# Altium project MotorBoard.PrjPcb
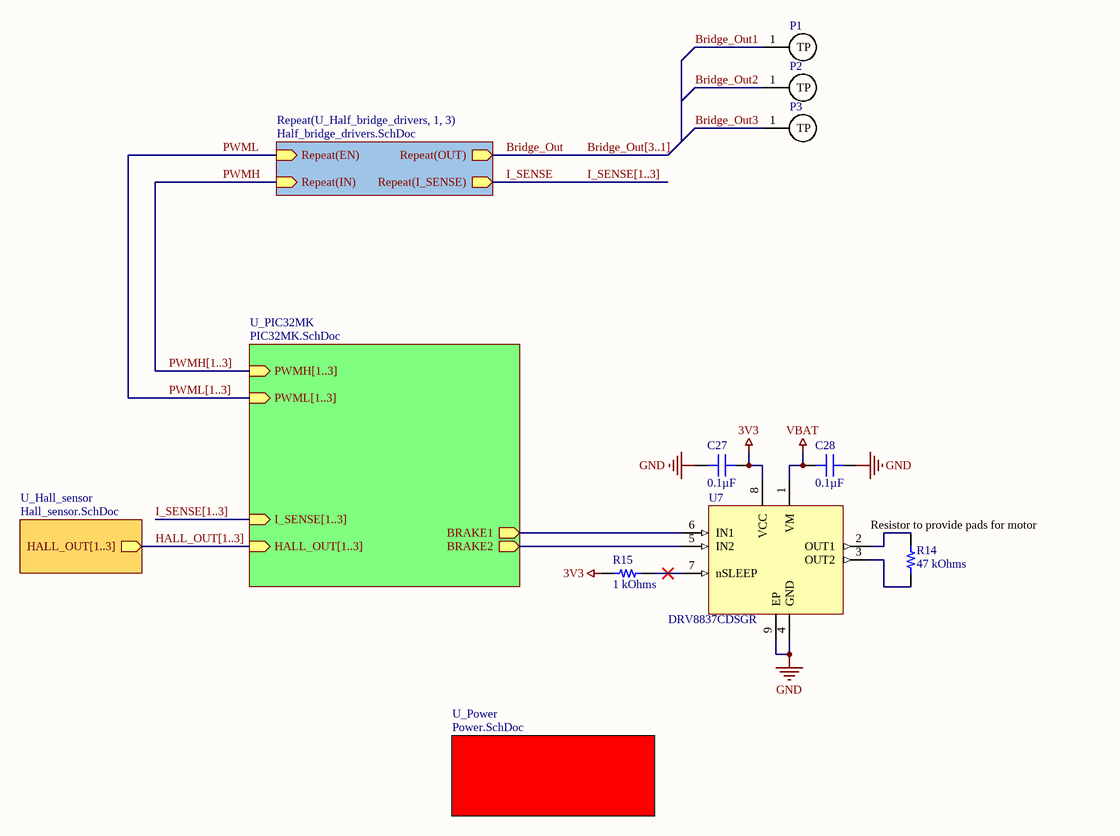
[diagram p0: Top.SchDoc]
7 sheets, 92 parts. Net scope: hierarchical (ports join the sheet entries above them; power ports are global).
Board file: MotorBoard.PcbDoc
Sheets:
  Top.SchDoc
    U_Half_bridge_drivers1 = Half_bridge_drivers.SchDoc
    U_Half_bridge_drivers2 = Half_bridge_drivers.SchDoc
    U_Half_bridge_drivers3 = Half_bridge_drivers.SchDoc
    U_Hall_sensor = Hall_sensor.SchDoc
    U_PIC32MK = PIC32MK.SchDoc
    U_Power = Power.SchDoc
      U_3V3_buck = 3V3_buck.SchDoc
      U_1V65_LDO = 1V65_LDO.SchDoc

## Sheet Top.SchDoc
size B; DocumentNumber: 7; Revision: 1.0; SheetNumber: 1; SheetTotal: 7

### Parts
C27  0.1µF  [CAP 0603_1608]
C28  0.1µF  [CAP 0603_1608]
P1  TP  [2mmHole]  (value not drawn)
P2  TP  [2mmHole]  (value not drawn)
P3  TP  [2mmHole]  (value not drawn)
R14  47 kOhms  [RES 2512_6432]
R15  1 kOhms  [RES 0603_1608]
U7  DRV8837CDSGR  [SON50P200X200X80-9N]

### Sub-sheets
Repeat(U_Half_bridge_drivers, 1, 3) = Half_bridge_drivers.SchDoc: Repeat(EN) (in), Repeat(IN) (in), Repeat(OUT) (out), Repeat(I_SENSE) (out)
U_Hall_sensor = Hall_sensor.SchDoc: HALL_OUT[1..3] (out)
U_PIC32MK = PIC32MK.SchDoc: I_SENSE[1..3] (in), HALL_OUT[1..3] (in), PWMH[1..3] (in), PWML[1..3] (in), BRAKE2 (out), BRAKE1 (out)
U_Power = Power.SchDoc: no entries

### Nets
3V3: C27.2 R15.2 U7.8(VCC)
GND: C27.1 C28.2 U7.4(GND) U7.9(EP)
VBAT: C28.1 U7.1(VM)
Bridge_Out: sheet Repeat(U_Half_bridge_drivers, 1, 3)/Repeat(OUT)
Bridge_Out1: P1.1(TP)
Bridge_Out2: P2.1(TP)
Bridge_Out3: P3.1(TP)
I_SENSE: sheet Repeat(U_Half_bridge_drivers, 1, 3)/Repeat(I_SENSE)
PWMH: sheet Repeat(U_Half_bridge_drivers, 1, 3)/Repeat(IN)
PWML: sheet Repeat(U_Half_bridge_drivers, 1, 3)/Repeat(EN)
NetR14_1: R14.1 U7.2(OUT1)
NetR14_2: R14.2 U7.3(OUT2)
NetR15_1: R15.1 U7.7(nSLEEP)
NetU6_53: U7.5(IN2) ; sheet U_PIC32MK/BRAKE2
NetU6_54: U7.6(IN1) ; sheet U_PIC32MK/BRAKE1

### Buses and harness runs
bus Bridge_Out[3..1]
bus HALL_OUT[1..3] = sheet U_Hall_sensor/HALL_OUT[1..3] = sheet U_PIC32MK/HALL_OUT[1..3]
bus I_SENSE[1..3]
bus I_SENSE[1..3] = sheet U_PIC32MK/I_SENSE[1..3]
bus PWMH[1..3] = sheet U_PIC32MK/PWMH[1..3]
bus PWML[1..3] = sheet U_PIC32MK/PWML[1..3]

### Notes on the sheet
- (near R14) Resistor to provide pads for motor

### Library data of the parts
C27 C28 = GCG188R92A104KA03D: CAP CER 0.1UF 100V 0603 EPOXY; Manufacturer: Murata Electronics; Temperature Coefficient: X8R; Tolerance: ±10%; Part Number: GCG188R92A104KA03D; Value: 0.1µF; Applications: Automotive; Capacitance: 0.1µF; ComponentLink1Description: Datasheet; ComponentLink1URL: https://search.murata.co.jp/Ceramy/image/img/A01X/G101/ENG/GCG188R92A104KA03-01.pdf; ComponentLink2Description: DigiKey Link; ComponentLink2URL: http://digikey.com/product-detail/en/murata-electronics/GCG188R92A104KA03D/490-18197-1-ND/9867926; Device Package: 0603 (1608 Metric); Features: Epoxy Mountable; LastUpdated: 21-Jan-20 12:01:59 AM; Lifecycle Status: Active; Minimum Order: 1; Mounting Type: Surface Mount, MLCC, Epoxy; Operating Temperature: -55°C ~ 150°C; Package / Case: 0603 (1608 Metric); Packaging: TapeAndReel; PartId: 9025; Part Status: Active; Price: 0.07; Ratings: AEC-Q200; Series: GCG; Size / Dimension: 0.063" L x 0.031" W (1.60mm x 0.80mm); Supplier 1: DigiKey; Supplier Part Number 1: 490-18197-1-ND; Thickness (Max): 0.035" (0.90mm); Voltage - Rated: 100V
R14 = RK73B3ATTE473J: RES 47K OHM 5% 1W 2512; Manufacturer: KOA Speer Electronics, Inc.; Temperature Coefficient: ±200ppm/°C; Part Number: RK73B3ATTE473J; ComponentLink1Description: Datasheet; ComponentLink1URL: http://www.koaspeer.com/catimages/Products/RK73B/RK73B.pdf; ComponentLink2Description: DigiKey Link; ComponentLink2URL: http://digikey.com/product-detail/en/koa-speer-electronics-inc/RK73B3ATTE473J/2019-RK73B3ATTE473JCT-ND/10425370; Composition: Thick Film; Device Package: 2512 (6432 Metric); Features: Automotive AEC-Q200, Moisture Resistant; Height - Seated (Max): 0.028" (0.70mm); LastUpdated: 21-Jan-20 4:26:21 AM; Lifecycle Status: Active; Minimum Order: 1; Number of Terminations: 2; Operating Temperature: -55°C ~ 155°C; Package / Case: 2512 (6432 Metric); Packaging: TapeAndReel; Part Status: Active; Power (Watts): 1W; Price: 0.04; Ratings: AEC-Q200; Resistance: 47 kOhms; Series: RK73B; Size / Dimension: 0.248" L x 0.122" W (6.30mm x 3.10mm); Supplier 1: DigiKey; Supplier Part Number 1: 2019-RK73B3ATTE473JCT-ND; Supplier Device Package: 2512; Tolerance: ±5%; Value: 47 kOhms
R15 = RT0603FRE071KL: RES SMD 1K OHM 1% 1/10W 0603; Manufacturer: Yageo; Power (Watts): 0.1W, 1/10W; Temperature Coefficient: ±50ppm/°C; Part Number: RT0603FRE071KL; Value: 1 kOhms; ComponentLink1Description: Datasheet; ComponentLink1URL: https://www.yageo.com/upload/media/product/productsearch/datasheet/rchip/PYu-RT_1-to-0.01_RoHS_L_11.pdf; ComponentLink2Description: DigiKey Link; ComponentLink2URL: http://digikey.com/product-detail/en/yageo/RT0603FRE071KL/YAG2323CT-ND/5252437; Composition: Thin Film; Device Package: 0603 (1608 Metric); Height - Seated (Max): 0.022" (0.55mm); LastUpdated: 21-Jan-20 12:24:38 AM; Lifecycle Status: Active; Minimum Order: 1; Number of Terminations: 2; Operating Temperature: -55°C ~ 155°C; Package / Case: 0603 (1608 Metric); Packaging: TapeAndReel; PartId: 5672; Part Status: Active; Price: 0.01; Resistance: 1 kOhms; Series: RT; Size / Dimension: 0.063" L x 0.031" W (1.60mm x 0.80mm); Supplier 1: DigiKey; Supplier Part Number 1: YAG2323CT-ND; Supplier Device Package: 0603; Tolerance: ±1%
U7 = DRV8837CDSGR: 11-V, 1-A H-bridge motor driver 8-WSON -40 to 85; MF: Texas Instruments; Mouser-Purchase-URL: https://snapeda.com/shop?store=Mouser&id=617854; Value: *; DigiKey-Purchase-URL: https://snapeda.com/shop?store=DigiKey&id=617854; Package: WSON-8 Texas Instruments; Texas_Instruments-Purchase-URL: https://snapeda.com/shop?store=Texas+Instruments&id=617854; Price: None; MP: DRV8837CDSGR; SnapEDA_Link: https://www.snapeda.com/parts/DRV8837CDSGR/Texas%20Instruments/view-part/617854/?ref=snap; Availability: Good

## Sheet Half_bridge_drivers.SchDoc
size B; DocumentNumber: 3; SheetNumber: 2; SheetTotal: 7
Used 3 times, as channels U_Half_bridge_drivers1, U_Half_bridge_drivers2, U_Half_bridge_drivers3. Parts and nets are listed once, with the designators drawn on the sheet.
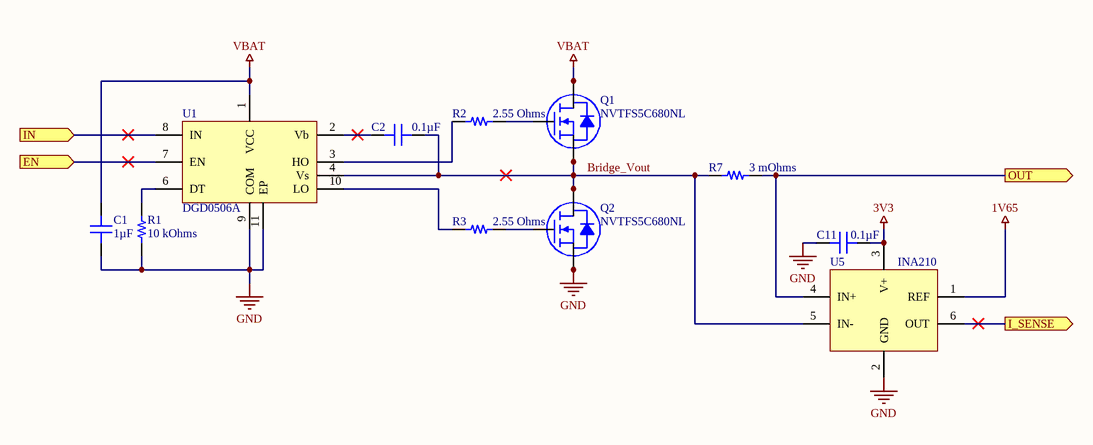
[diagram p1: Half_bridge_drivers.SchDoc]

### Parts
C1  1µF  [CAP 0603_1608]
C2  0.1µF  [CAP 0603_1608]
C11  0.1µF  [CAP 0603_1608]
Q1  NVTFS5C680NL  [NVTFS015N04CTAG]
Q2  NVTFS5C680NL  [NVTFS015N04CTAG]
R1  10 kOhms  [RES 0603_1608]
R2  2.55 Ohms  [RES 0603_1608]
R3  2.55 Ohms  [RES 0603_1608]
R7  3 mOhms  [STACKPOLE CSR0603]
U1  DGD0506A  [10-WDFN3030]
U5  INA210  [TI SC70-6 DCK]

### Ports
EN (in), I_SENSE (out), IN (in), OUT (out)

### Nets
1V65: U5.1(REF)
3V3: C11.2 U5.3(V+)
GND: C1.1 C11.1 Q2.1(S) Q2.2(S) Q2.3(S) R1.2 U1.9(COM) U1.11(EP) U5.2(GND)
VBAT: C1.2 Q1.5(D) Q1.6(D) Q1.7(D) Q1.8(D) U1.1(VCC)
Bridge_Vout: C2.1 Q1.1(S) Q1.2(S) Q1.3(S) Q2.5(D) Q2.6(D) Q2.7(D) Q2.8(D) R7.1 U1.4(Vs) U5.5(IN-)
EN: U1.7(EN) ; port EN
I_SENSE: U5.6(OUT) ; port I_SENSE
IN: U1.8(IN) ; port IN
OUT: R7.2 U5.4(IN+) ; port OUT
NetC2_2: C2.2 U1.2(Vb)
NetQ1_4: Q1.4(G) R2.2
NetQ2_4: Q2.4(G) R3.2
NetR1_1: R1.1 U1.6(DT)
NetR2_1: R2.1 U1.3(HO)
NetR3_1: R3.1 U1.10(LO)

### Channels
U_Half_bridge_drivers1: designators end in _1; ports EN=PWML1 I_SENSE=I_SENSE1 IN=PWMH1 OUT=Bridge_Out1
U_Half_bridge_drivers2: designators end in _2; ports EN=PWML2 I_SENSE=I_SENSE2 IN=PWMH2 OUT=Bridge_Out2
U_Half_bridge_drivers3: designators end in _3; ports EN=PWML3 I_SENSE=I_SENSE3 IN=PWMH3 OUT=Bridge_Out3

### Library data of the parts
C1 = GCJ188R71E105KA01D: CAP CER 1UF 25V X7R 0603; Manufacturer: Murata Electronics; Tolerance: ±10%; Part Number: GCJ188R71E105KA01D; Value: 1µF; Applications: Automotive, Boardflex Sensitive; Capacitance: 1µF; ComponentLink1Description: Datasheet; ComponentLink1URL: https://search.murata.co.jp/Ceramy/image/img/A01X/G101/ENG/GCJ188R71E105KA01-01.pdf; ComponentLink2Description: DigiKey Link; ComponentLink2URL: http://digikey.com/product-detail/en/murata-electronics/GCJ188R71E105KA01D/490-14409-1-ND/6606870; Device Package: 0603 (1608 Metric); Features: Soft Termination; LastUpdated: 21-Jan-20 12:01:58 AM; Lifecycle Status: Active; Minimum Order: 1; Mounting Type: Surface Mount, MLCC; Operating Temperature: -55°C ~ 125°C; Package / Case: 0603 (1608 Metric); Packaging: TapeAndReel; PartId: 9566; Part Status: Active; Price: 0.05; Ratings: AEC-Q200; Series: GCJ; Size / Dimension: 0.063" L x 0.031" W (1.60mm x 0.80mm); Supplier 1: DigiKey; Supplier Part Number 1: 490-14409-1-ND; Temperature Coefficient: X7R; Thickness (Max): 0.035" (0.90mm); Voltage - Rated: 25V
C2 C11 = GCG188R92A104KA03D: as C27 on sheet Top; Part Number: GCG188R92A104KA03D; Value: 0.1µF; Applications: Automotive; Capacitance: 0.1µF; ComponentLink1Description: Datasheet; ComponentLink1URL: https://search.murata.co.jp/Ceramy/image/img/A01X/G101/ENG/GCG188R92A104KA03-01.pdf; ComponentLink2Description: DigiKey Link; ComponentLink2URL: http://digikey.com/product-detail/en/murata-electronics/GCG188R92A104KA03D/490-18197-1-ND/9867926; Device Package: 0603 (1608 Metric); Features: Epoxy Mountable; LastUpdated: 21-Jan-20 12:01:59 AM; Lifecycle Status: Active; Minimum Order: 1; Mounting Type: Surface Mount, MLCC, Epoxy; Operating Temperature: -55°C ~ 150°C; Package / Case: 0603 (1608 Metric); Packaging: TapeAndReel; PartId: 9025; Part Status: Active; Price: 0.07; Ratings: AEC-Q200; Series: GCG; Size / Dimension: 0.063" L x 0.031" W (1.60mm x 0.80mm); Supplier 1: DigiKey; Supplier Part Number 1: 490-18197-1-ND; Thickness (Max): 0.035" (0.90mm); Voltage - Rated: 100V
R1 = RNCS0603BKE10K0: RES 10K OHM 0.1% 1/16W 0603; Manufacturer: Stackpole Electronics Inc; Power (Watts): 0.063W, 1/16W; Temperature Coefficient: ±25ppm/°C; Part Number: RNCS0603BKE10K0; Value: 10 kOhms; ComponentLink1Description: Datasheet; ComponentLink1URL: https://www.seielect.com/catalog/sei-rncs_rnch.pdf; ComponentLink2Description: DigiKey Link; ComponentLink2URL: http://digikey.com/product-detail/en/stackpole-electronics-inc/RNCS0603BKE10K0/RNCS0603BKE10K0CT-ND/1800113; Composition: Thin Film; Device Package: 0603 (1608 Metric); Features: Anti-Corrosive, Automotive AEC-Q200, Moisture Resistant; Height - Seated (Max): 0.022" (0.55mm); LastUpdated: 21-Jan-20 12:25:01 AM; Lifecycle Status: Active; Minimum Order: 1; Number of Terminations: 2; Operating Temperature: -55°C ~ 155°C; Package / Case: 0603 (1608 Metric); Packaging: TapeAndReel; PartId: 4838; Part Status: Active; Price: 0.08; Ratings: AEC-Q200; Resistance: 10 kOhms; Series: RNCS; Size / Dimension: 0.061" L x 0.031" W (1.55mm x 0.80mm); Supplier 1: DigiKey; Supplier Part Number 1: RNCS0603BKE10K0CT-ND; Supplier Device Package: 0603; Tolerance: ±0.1%
R2 R3 = CRCW06032R55FKEA: RES SMD 2.55 OHM 1% 1/10W 0603; Manufacturer: Vishay Dale; Power (Watts): 0.1W, 1/10W; Temperature Coefficient: ±100ppm/°C; Part Number: CRCW06032R55FKEA; Value: 2.55 Ohms; ComponentLink1Description: Datasheet; ComponentLink1URL: http://www.vishay.com/docs/20035/dcrcwe3.pdf; ComponentLink2Description: DigiKey Link; ComponentLink2URL: http://digikey.com/product-detail/en/vishay-dale/CRCW06032R55FKEA/541-2.55HHCT-ND/1962041; Composition: Thick Film; Device Package: 0603 (1608 Metric); Features: Automotive AEC-Q200; Height - Seated (Max): 0.020" (0.50mm); LastUpdated: 21-Jan-20 12:16:55 AM; Lifecycle Status: Active; Minimum Order: 1; Number of Terminations: 2; Operating Temperature: -55°C ~ 155°C; Package / Case: 0603 (1608 Metric); Packaging: CutTape; PartId: 23466; Part Status: Active; Price: 0.10; Ratings: AEC-Q200; Resistance: 2.55 Ohms; Series: CRCW; Size / Dimension: 0.061" L x 0.033" W (1.55mm x 0.85mm); Supplier 1: DigiKey; Supplier Part Number 1: 541-2.55HHCT-ND; Supplier Device Package: 0603; Tolerance: ±1%
R7 = CSS0603FT3L00: RES SHUNT, 0603, 0.003 OHM, 1%,; Manufacturer: Stackpole Electronics Inc; Power (Watts): 0.333W, 1/3W; Temperature Coefficient: ±100ppm/°C; Part Number: CSS0603FT3L00; ComponentLink2Description: DigiKey Link; ComponentLink2URL: http://digikey.com/product-detail/en/stackpole-electronics-inc/CSS0603FT3L00/738-CSS0603FT3L00CT-ND/10719388; Composition: Metal Element; Device Package: 0603 (1608 Metric); Features: Automotive AEC-Q200, Current Sense; Height - Seated (Max): 0.026" (0.65mm); LastUpdated: 19-Jul-20 11:45:32 PM; Lifecycle Status: Active; Minimum Order: 1; Number of Terminations: 2; Operating Temperature: -55°C ~ 155°C; Packaging: TapeAndReel; PartId: 1932; Part Status: Active; Price: 0.10; Ratings: AEC-Q200; Resistance: 3 mOhms; Series: CSS; Size / Dimension: 0.063" L x 0.031" W (1.60mm x 0.80mm); Supplier 1: DigiKey; Supplier Part Number 1: 738-CSS0603FT3L00CT-ND; Supplier Device Package: 0603; Tolerance: ±1%; Value: 3 mOhms
U1 = DGD0506A: Half Bridge driver - N FET
U5 = INA210: Current sense amplifier

## Sheet Hall_sensor.SchDoc
size B; DocumentNumber: 4; SheetNumber: 3; SheetTotal: 7
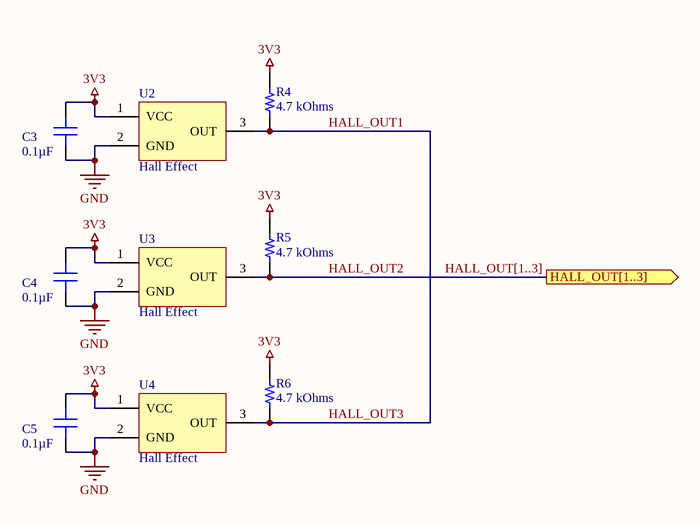
[diagram p2: Hall_sensor.SchDoc]

### Parts
C3  0.1µF  [CAP 0603_1608]
C4  0.1µF  [CAP 0603_1608]
C5  0.1µF  [CAP 0603_1608]
R4  4.7 kOhms  [RES 0603_1608]
R5  4.7 kOhms  [RES 0603_1608]
R6  4.7 kOhms  [RES 0603_1608]
U2  Hall Effect  [DRV5011ADLPG]
U3  Hall Effect  [DRV5011ADLPG]
U4  Hall Effect  [DRV5011ADLPG]

### Ports
HALL_OUT[1..3] (out)

### Nets
3V3: C3.1 C4.1 C5.1 R4.2 R5.1 R6.1 U2.1(VCC) U3.1(VCC) U4.1(VCC)
GND: C3.2 C4.2 C5.2 U2.2(GND) U3.2(GND) U4.2(GND)
HALL_OUT1: R4.1 U2.3(OUT)
HALL_OUT2: R5.2 U3.3(OUT)
HALL_OUT3: R6.2 U4.3(OUT)

### Buses and harness runs
bus HALL_OUT[1..3] = port HALL_OUT[1..3]

### Library data of the parts
C3-C5 = GCG188R92A104KA03D: as C27 on sheet Top; Part Number: GCG188R92A104KA03D; Value: 0.1µF; Applications: Automotive; Capacitance: 0.1µF; ComponentLink1Description: Datasheet; ComponentLink1URL: https://search.murata.co.jp/Ceramy/image/img/A01X/G101/ENG/GCG188R92A104KA03-01.pdf; ComponentLink2Description: DigiKey Link; ComponentLink2URL: http://digikey.com/product-detail/en/murata-electronics/GCG188R92A104KA03D/490-18197-1-ND/9867926; Device Package: 0603 (1608 Metric); Features: Epoxy Mountable; LastUpdated: 21-Jan-20 12:01:59 AM; Lifecycle Status: Active; Minimum Order: 1; Mounting Type: Surface Mount, MLCC, Epoxy; Operating Temperature: -55°C ~ 150°C; Package / Case: 0603 (1608 Metric); Packaging: TapeAndReel; PartId: 9025; Part Status: Active; Price: 0.07; Ratings: AEC-Q200; Series: GCG; Size / Dimension: 0.063" L x 0.031" W (1.60mm x 0.80mm); Supplier 1: DigiKey; Supplier Part Number 1: 490-18197-1-ND; Thickness (Max): 0.035" (0.90mm); Voltage - Rated: 100V
R4-R6 = CRCW06034K70FKTA: RES SMD 4.7K OHM 1% 1/10W 0603; Manufacturer: Vishay Dale; Power (Watts): 0.1W, 1/10W; Temperature Coefficient: ±100ppm/°C; Part Number: CRCW06034K70FKTA; Value: 4.7 kOhms; ComponentLink1Description: Datasheet; ComponentLink1URL: http://www.vishay.com/docs/20008/dcrcw.pdf; ComponentLink2Description: DigiKey Link; ComponentLink2URL: http://digikey.com/product-detail/en/vishay-dale/CRCW06034K70FKTA/541-3004-1-ND/6073647; Composition: Thick Film; Device Package: 0603 (1608 Metric); Features: Automotive AEC-Q200; Height - Seated (Max): 0.020" (0.50mm); LastUpdated: 21-Jan-20 12:16:37 AM; Lifecycle Status: Active; Minimum Order: 1; Number of Terminations: 2; Operating Temperature: -55°C ~ 155°C; Package / Case: 0603 (1608 Metric); Packaging: TapeAndReel; PartId: 23863; Part Status: Active; Price: 0.01; Ratings: AEC-Q200; Resistance: 4.7 kOhms; Series: CRCW; Size / Dimension: 0.063" L x 0.033" W (1.60mm x 0.85mm); Supplier 1: DigiKey; Supplier Part Number 1: 541-3004-1-ND; Supplier Device Package: 0603; Tolerance: ±1%
U2-U4 = DRV5011

## Sheet PIC32MK.SchDoc
size B; DocumentNumber: 5; SheetNumber: 4; SheetTotal: 7
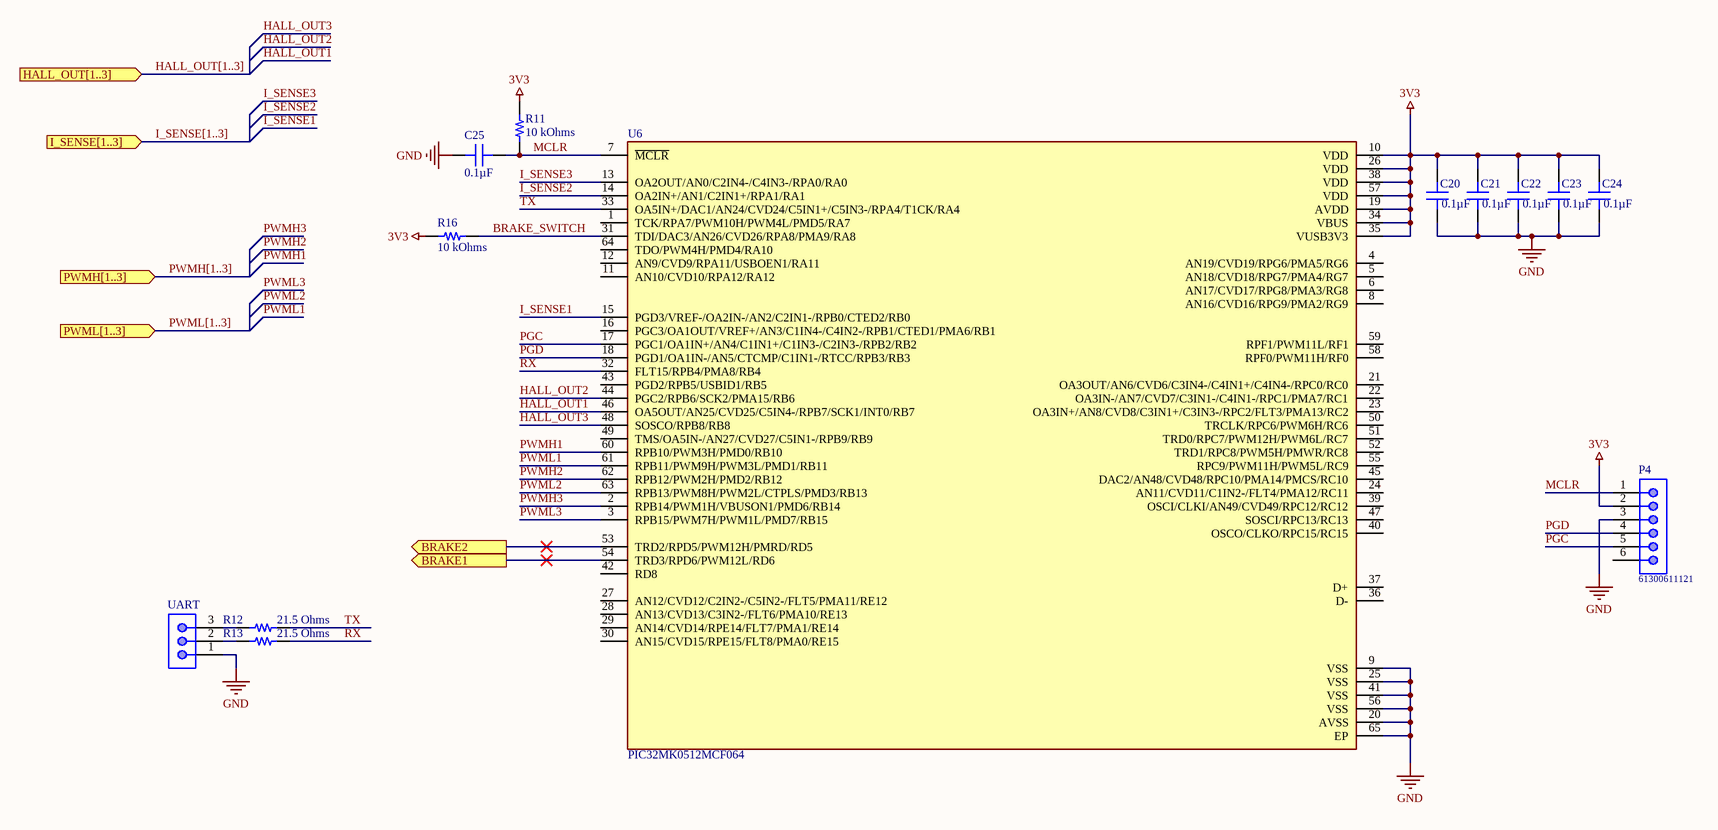
[diagram p3: PIC32MK.SchDoc]

### Parts
C20  0.1µF  [CAP 0603_1608]
C21  0.1µF  [CAP 0603_1608]
C22  0.1µF  [CAP 0603_1608]
C23  0.1µF  [CAP 0603_1608]
C24  0.1µF  [CAP 0603_1608]
C25  0.1µF  [CAP 0603_1608]
P4  61300611121  [61300611121]
R11  10 kOhms  [RES 0603_1608]
R12  21.5 Ohms  [RES 0603_1608]
R13  21.5 Ohms  [RES 0603_1608]
R16  10 kOhms  [RES 0603_1608]
U6  PIC32MK0512MCF064  [QFN50P900X900X100-65N]
UART  3 pin 2mm JST Male  [3pin - 2mm header]  (value not drawn)

### Ports
BRAKE1 (out), BRAKE2 (out), HALL_OUT[1..3] (in), I_SENSE[1..3] (in), PWMH[1..3] (in), PWML[1..3] (in)

### Nets
3V3: C20.1 C21.1 C22.1 C23.1 C24.1 P4.2 R11.2 R16.2 U6.10(VDD) U6.19(AVDD) U6.26(VDD) U6.34(VBUS) U6.35(VUSB3V3) U6.38(VDD) U6.57(VDD)
GND: C20.2 C21.2 C22.2 C23.2 C24.2 C25.2 P4.3 U6.9(VSS) U6.20(AVSS) U6.25(VSS) U6.41(VSS) U6.56(VSS) U6.65(EP) UART.1
BRAKE_SWITCH: R16.1 U6.31(TDI/DAC3/AN26/CVD26/RPA8/PMA9/RA8)
HALL_OUT1: U6.46(OA5OUT/AN25/CVD25/C5IN4-/RPB7/SCK1/INT0/RB7)
HALL_OUT2: U6.44(PGC2/RPB6/SCK2/PMA15/RB6)
HALL_OUT3: U6.48(SOSCO/RPB8/RB8)
I_SENSE1: U6.15(PGD3/VREF-/OA2IN-/AN2/C2IN1-/RPB0/CTED2/RB0)
I_SENSE2: U6.14(OA2IN+/AN1/C2IN1+/RPA1/RA1)
I_SENSE3: U6.13(OA2OUT/AN0/C2IN4-/C4IN3-/RPA0/RA0)
MCLR: C25.1 P4.1 R11.1 U6.7(~{MCLR})
PGC: P4.5 U6.17(PGC1/OA1IN+/AN4/C1IN1+/C1IN3-/C2IN3-/RPB2/RB2)
PGD: P4.4 U6.18(PGD1/OA1IN-/AN5/CTCMP/C1IN1-/RTCC/RPB3/RB3)
PWMH1: U6.60(RPB10/PWM3H/PMD0/RB10)
PWMH2: U6.62(RPB12/PWM2H/PMD2/RB12)
PWMH3: U6.2(RPB14/PWM1H/VBUSON1/PMD6/RB14)
PWML1: U6.61(RPB11/PWM9H/PWM3L/PMD1/RB11)
PWML2: U6.63(RPB13/PWM8H/PWM2L/CTPLS/PMD3/RB13)
PWML3: U6.3(RPB15/PWM7H/PWM1L/PMD7/RB15)
RX: R13.2 U6.32(FLT15/RPB4/PMA8/RB4)
TX: R12.2 U6.33(OA5IN+/DAC1/AN24/CVD24/C5IN1+/C5IN3-/RPA4/T1CK/RA4)
NetR12_1: R12.1 UART.3
NetR13_1: R13.1 UART.2
NetU6_53: U6.53(TRD2/RPD5/PWM12H/PMRD/RD5) ; port BRAKE2
NetU6_54: U6.54(TRD3/RPD6/PWM12L/RD6) ; port BRAKE1

Not connected (* = marked no-connect by the designer): P4 6; U6 1(TCK/RPA7/PWM10H/PWM4L/PMD5/RA7) 4(AN19/CVD19/RPG6/PMA5/RG6) 5(AN18/CVD18/RPG7/PMA4/RG7) 6(AN17/CVD17/RPG8/PMA3/RG8) 8(AN16/CVD16/RPG9/PMA2/RG9) 11(AN10/CVD10/RPA12/RA12) 12(AN9/CVD9/RPA11/USBOEN1/RA11) 16(PGC3/OA1OUT/VREF+/AN3/C1IN4-/C4IN2-/RPB1/CTED1/PMA6/RB1) 21(OA3OUT/AN6/CVD6/C3IN4-/C4IN1+/C4IN4-/RPC0/RC0) 22(OA3IN-/AN7/CVD7/C3IN1-/C4IN1-/RPC1/PMA7/RC1) 23(OA3IN+/AN8/CVD8/C3IN1+/C3IN3-/RPC2/FLT3/PMA13/RC2) 24(AN11/CVD11/C1IN2-/FLT4/PMA12/RC11) 27(AN12/CVD12/C2IN2-/C5IN2-/FLT5/PMA11/RE12) 28(AN13/CVD13/C3IN2-/FLT6/PMA10/RE13) 29(AN14/CVD14/RPE14/FLT7/PMA1/RE14) 30(AN15/CVD15/RPE15/FLT8/PMA0/RE15) 36(D-) 37(D+) 39(OSCI/CLKI/AN49/CVD49/RPC12/RC12) 40(OSCO/CLKO/RPC15/RC15) 42(RD8) 43(PGD2/RPB5/USBID1/RB5) 45(DAC2/AN48/CVD48/RPC10/PMA14/PMCS/RC10) 47(SOSCI/RPC13/RC13) 49(TMS/OA5IN-/AN27/CVD27/C5IN1-/RPB9/RB9) 50(TRCLK/RPC6/PWM6H/RC6) 51(TRD0/RPC7/PWM12H/PWM6L/RC7) 52(TRD1/RPC8/PWM5H/PMWR/RC8) 55(RPC9/PWM11H/PWM5L/RC9) 58(RPF0/PWM11H/RF0) 59(RPF1/PWM11L/RF1) 64(TDO/PWM4H/PMD4/RA10)

### Buses and harness runs
bus HALL_OUT[1..3] = port HALL_OUT[1..3]
bus I_SENSE[1..3] = port I_SENSE[1..3]
bus PWMH[1..3] = port PWMH[1..3]
bus PWML[1..3] = port PWML[1..3]

### Library data of the parts
C20-C25 = GCG188R92A104KA03D: as C27 on sheet Top; Part Number: GCG188R92A104KA03D; Value: 0.1µF; Applications: Automotive; Capacitance: 0.1µF; ComponentLink1Description: Datasheet; ComponentLink1URL: https://search.murata.co.jp/Ceramy/image/img/A01X/G101/ENG/GCG188R92A104KA03-01.pdf; ComponentLink2Description: DigiKey Link; ComponentLink2URL: http://digikey.com/product-detail/en/murata-electronics/GCG188R92A104KA03D/490-18197-1-ND/9867926; Device Package: 0603 (1608 Metric); Features: Epoxy Mountable; LastUpdated: 21-Jan-20 12:01:59 AM; Lifecycle Status: Active; Minimum Order: 1; Mounting Type: Surface Mount, MLCC, Epoxy; Operating Temperature: -55°C ~ 150°C; Package / Case: 0603 (1608 Metric); Packaging: TapeAndReel; PartId: 9025; Part Status: Active; Price: 0.07; Ratings: AEC-Q200; Series: GCG; Size / Dimension: 0.063" L x 0.031" W (1.60mm x 0.80mm); Supplier 1: DigiKey; Supplier Part Number 1: 490-18197-1-ND; Thickness (Max): 0.035" (0.90mm); Voltage - Rated: 100V
P4 = 61300611121: WR-PHD Pin Header, THT, pitch 2.54mm, Single Row, Vertical, 6p; Manufacturer: Wurth Elektronik; Pin Number: 6; Rated Current: 3A; Working Voltage: 250VAC; Withstanding Voltage: 500VAC; Contact Resistance: 20mOhm; ComponentLink1Description: Manufacturer; ComponentLink1URL: http://www.we-online.de; ComponentLink2Description: Datasheet; ComponentLink2URL: https://www.we-online.com/catalog/datasheet/61300611121.pdf; Manufacturer Part Number: 61300611121; Published Date: May 2020; Pitch: 2.54mm; Operating Temperature: -40 to +105degC; Mounting Technology: THT; Packaging: Bag; Gender: Pin Header; Row Number: Single; Orientation: Vertical
R11 R16 = RNCS0603BKE10K0: as R1 on sheet Half_bridge_drivers; Part Number: RNCS0603BKE10K0; Value: 10 kOhms; ComponentLink1Description: Datasheet; ComponentLink1URL: https://www.seielect.com/catalog/sei-rncs_rnch.pdf; ComponentLink2Description: DigiKey Link; ComponentLink2URL: http://digikey.com/product-detail/en/stackpole-electronics-inc/RNCS0603BKE10K0/RNCS0603BKE10K0CT-ND/1800113; Composition: Thin Film; Device Package: 0603 (1608 Metric); Features: Anti-Corrosive, Automotive AEC-Q200, Moisture Resistant; Height - Seated (Max): 0.022" (0.55mm); LastUpdated: 21-Jan-20 12:25:01 AM; Lifecycle Status: Active; Minimum Order: 1; Number of Terminations: 2; Operating Temperature: -55°C ~ 155°C; Package / Case: 0603 (1608 Metric); Packaging: TapeAndReel; PartId: 4838; Part Status: Active; Price: 0.08; Ratings: AEC-Q200; Resistance: 10 kOhms; Series: RNCS; Size / Dimension: 0.061" L x 0.031" W (1.55mm x 0.80mm); Supplier 1: DigiKey; Supplier Part Number 1: RNCS0603BKE10K0CT-ND; Supplier Device Package: 0603; Tolerance: ±0.1%
R12 R13 = ERJ-3EKF21R5V: RES SMD 21.5 OHM 1% 1/10W 0603; Manufacturer: Panasonic Electronic Components; Power (Watts): 0.1W, 1/10W; Temperature Coefficient: ±100ppm/°C; Part Number: ERJ-3EKF21R5V; Value: 21.5 Ohms; ComponentLink1Description: Datasheet; ComponentLink1URL: https://industrial.panasonic.com/cdbs/www-data/pdf/RDA0000/AOA0000C304.pdf; ComponentLink2Description: DigiKey Link; ComponentLink2URL: http://digikey.com/product-detail/en/panasonic-electronic-components/ERJ-3EKF21R5V/P21.5HCT-ND/198246; Composition: Thick Film; Device Package: 0603 (1608 Metric); Features: Automotive AEC-Q200; Height - Seated (Max): 0.022" (0.55mm); LastUpdated: 21-Jan-20 12:16:19 AM; Lifecycle Status: Active; Minimum Order: 1; Number of Terminations: 2; Operating Temperature: -55°C ~ 155°C; Package / Case: 0603 (1608 Metric); Packaging: TapeAndReel; PartId: 24202; Part Status: Active; Price: 0.01; Ratings: AEC-Q200; Resistance: 21.5 Ohms; Series: ERJ; Size / Dimension: 0.063" L x 0.031" W (1.60mm x 0.80mm); Supplier 1: DigiKey; Supplier Part Number 1: P21.5HCT-ND; Supplier Device Package: 0603; Tolerance: ±1%
U6 = PIC32MK0512MCF064: PIC32MK Microcontroller IC 32-Bit 120MHz 1MB _1M x 8_ FLASH 64-TQFP _10x10_; MP: PIC32MK1024MCF064-I/PT; MF: Microchip; Digi-Key_Purchase_URL: https://www.digikey.kr/product-detail/en/microchip-technology/PIC32MK1024MCF064-I-PT/PIC32MK1024MCF064-I-PT-ND/7164902?utm_source=snapeda&utm_medium=aggregator&utm_campaign=symbol; Package: TQFP-64 Microchip; Digi-Key_Part_Number: PIC32MK1024MCF064-I/PT-ND; Value: *; SnapEDA_Link: https://www.snapeda.com/parts/PIC32MK1024MCF064-I/PT/Microchip/view-part/876704/?ref=snap

## Sheet Power.SchDoc
size B; DocumentNumber: 6; SheetNumber: 5; SheetTotal: 7
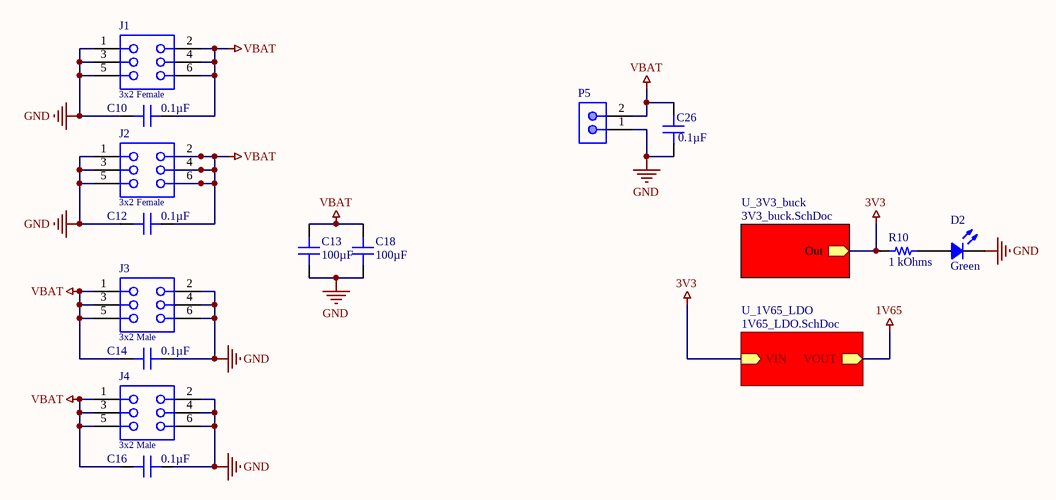
[diagram p4: Power.SchDoc]

### Parts
C10  0.1µF  [CAP 0603_1608]
C12  0.1µF  [CAP 0603_1608]
C13  100µF  [CAP 1210_3225 - 2.8MM]
C14  0.1µF  [CAP 0603_1608]
C16  0.1µF  [CAP 0603_1608]
C18  100µF  [CAP 1210_3225 - 2.8MM]
C26  0.1µF  [CAP 0603_1608]
D2  Green  [LED 0603_1608 GREEN]
J1  3x2 Female  [62000621821]
J2  3x2 Female  [62000621821]
J3  3x2 Male  [2mm 3x2 Male Right - duplicate]
J4  3x2 Male  [2mm 3x2 Male Right - duplicate]
P5  2 pin 2mm JST Male  [2pin - 2mm JST male]  (value not drawn)
R10  1 kOhms  [RES 0603_1608]

### Sub-sheets
U_1V65_LDO = 1V65_LDO.SchDoc: VOUT (out), VIN (in)
U_3V3_buck = 3V3_buck.SchDoc: Out (out)

### Nets
3V3: R10.1 ; sheet U_3V3_buck/Out, sheet U_1V65_LDO/VIN
GND: C10.1 C12.1 C13.1 C14.2 C16.2 C18.1 C26.2 D2.2 J1.1 J1.3 J1.5 J2.1 J2.3 J2.5 J3.2 J3.4 J3.6 J4.2 J4.4 J4.6 P5.1
VBAT: C10.2 C12.2 C13.2 C14.1 C16.1 C18.2 C26.1 J1.2 J1.4 J1.6 J2.2 J2.4 J2.6 J3.1 J3.3 J3.5 J4.1 J4.3 J4.5 P5.2
NetD2_1: D2.1 R10.2

### Library data of the parts
C10 C12 C14 C16 C26 = GCG188R92A104KA03D: as C27 on sheet Top; Part Number: GCG188R92A104KA03D; Value: 0.1µF; Applications: Automotive; Capacitance: 0.1µF; ComponentLink1Description: Datasheet; ComponentLink1URL: https://search.murata.co.jp/Ceramy/image/img/A01X/G101/ENG/GCG188R92A104KA03-01.pdf; ComponentLink2Description: DigiKey Link; ComponentLink2URL: http://digikey.com/product-detail/en/murata-electronics/GCG188R92A104KA03D/490-18197-1-ND/9867926; Device Package: 0603 (1608 Metric); Features: Epoxy Mountable; LastUpdated: 21-Jan-20 12:01:59 AM; Lifecycle Status: Active; Minimum Order: 1; Mounting Type: Surface Mount, MLCC, Epoxy; Operating Temperature: -55°C ~ 150°C; Package / Case: 0603 (1608 Metric); Packaging: TapeAndReel; PartId: 9025; Part Status: Active; Price: 0.07; Ratings: AEC-Q200; Series: GCG; Size / Dimension: 0.063" L x 0.031" W (1.60mm x 0.80mm); Supplier 1: DigiKey; Supplier Part Number 1: 490-18197-1-ND; Thickness (Max): 0.035" (0.90mm); Voltage - Rated: 100V
C13 C18 = EMK325ABJ107MM-P: CAP CER 100UF 16V X5R 1210; Manufacturer: Taiyo Yuden; Tolerance: ±20%; Part Number: EMK325ABJ107MM-P; Value: 100µF; Applications: General Purpose; Capacitance: 100µF; ComponentLink1Description: Datasheet; ComponentLink1URL: https://ds.yuden.co.jp/TYCOMPAS/ut/detail?pn=EMK325ABJ107MM-P &u=M; ComponentLink2Description: DigiKey Link; ComponentLink2URL: http://digikey.com/product-detail/en/taiyo-yuden/EMK325ABJ107MM-P/587-5426-1-ND/7067102; Device Package: 1210 (3225 Metric); LastUpdated: 21-Jan-20 12:30:21 AM; Lifecycle Status: Active; Minimum Order: 1; Mounting Type: Surface Mount, MLCC; Operating Temperature: -55°C ~ 85°C; Package / Case: 1210 (3225 Metric); Packaging: TapeAndReel; PartId: 24141; Part Status: Active; Price: 0.71; Series: M; Size / Dimension: 0.126" L x 0.098" W (3.20mm x 2.50mm); Supplier 1: DigiKey; Supplier Part Number 1: 587-5426-1-ND; Temperature Coefficient: X5R; Thickness (Max): 0.110" (2.80mm); Voltage - Rated: 16V
D2 = XZCDGK53W-8VF: 1.6X0.8MM LC GREEN PIXSOLED DOME; Manufacturer: SunLED; Configuration: Independent; Current - Test: 2mA; Lens Color: Colorless; Lens Size: 0.35mm Dia; Lens Style: Round with Domed Top; Lens Transparency: Clear; Millicandela Rating: 417mcd; Viewing Angle: 60°; Voltage - Forward (Vf) (Typ): 2.65V; Wavelength - Dominant: 525nm; Wavelength - Peak: 515nm; Part Number: XZCDGK53W-8VF; Color: Green; ComponentLink1Description: Datasheet; ComponentLink1URL: https://www.sunledusa.com/products/spec/XZCDGK53W-8VF.pdf; ComponentLink2Description: DigiKey Link; ComponentLink2URL: http://digikey.com/product-detail/en/sunled/XZCDGK53W-8VF/1497-XZCDGK53W-8VFCT-ND/10449792; Device Package: 0603 (1608 Metric); Height (Max): 1.10mm; LastUpdated: 21-Jan-20 3:12:09 AM; Lifecycle Status: Active; Minimum Order: 1; Mounting Type: Surface Mount; Package / Case: 0603 (1608 Metric); Packaging: Unknown; PartId: 938; Part Status: Active; Price: 0.18; Series: Ultra Low Current; Size / Dimension: 1.60mm L x 0.80mm W; Supplier 1: DigiKey; Supplier Part Number 1: 1497-XZCDGK53W-8VFCT-ND; Supplier Device Package: 2-SMD; Value: Green
J1 J2 = 62000621821: WR-PHD Socket Header, THT, pitch 2mm, Dual Row, Vertical, 6p; Manufacturer: Wurth Elektronik; Pin Number: 6; Rated Current: 2A; Working Voltage: 250VAC; Withstanding Voltage: 500VAC; Contact Resistance: 20mOhm; ComponentLink1Description: Manufacturer; ComponentLink1URL: http://www.we-online.de; ComponentLink2Description: Datasheet; ComponentLink2URL: https://www.we-online.com/catalog/datasheet/62000621821.pdf; Manufacturer Part Number: 62000621821; Published Date: May 2020; Pitch: 2mm; Operating Temperature: -40 to +105degC; Mounting Technology: THT; Packaging: Tube; Gender: Socket Header; Row Number: Dual; Orientation: Vertical
J3 J4 = 2mm Male 3x2 Right: Manufacturer Part Number: 62000621821; Manufacturer: Wurth Elektronik; Pin Number: 6; Gender: Socket Header; Rated Current: 2A; Working Voltage: 250VAC; Withstanding Voltage: 500VAC; Contact Resistance: 20mOhm; Row Number: Dual; ComponentLink1Description: Manufacturer; ComponentLink1URL: http://www.we-online.de; ComponentLink2Description: Datasheet; ComponentLink2URL: https://www.we-online.com/catalog/datasheet/62000621821.pdf; Published Date: May 2020; Pitch: 2mm; Operating Temperature: -40 to +105degC; Mounting Technology: THT; Packaging: Tube; Orientation: Vertical
R10 = RNCF0603DTE1K00: RES 1K OHM 0.5% 1/10W 0603; Manufacturer: Stackpole Electronics Inc; Power (Watts): 0.1W, 1/10W; Temperature Coefficient: ±25ppm/°C; Part Number: RNCF0603DTE1K00; Value: 1 kOhms; ComponentLink1Description: Datasheet; ComponentLink1URL: https://www.seielect.com/catalog/sei-rncf.pdf; ComponentLink2Description: DigiKey Link; ComponentLink2URL: http://digikey.com/product-detail/en/stackpole-electronics-inc/RNCF0603DTE1K00/RNCF0603DTE1K00CT-ND/9915086; Composition: Thin Film; Device Package: 0603 (1608 Metric); Features: Automotive AEC-Q200; Height - Seated (Max): 0.022" (0.55mm); LastUpdated: 21-Jan-20 12:14:28 AM; Lifecycle Status: Active; Minimum Order: 1; Number of Terminations: 2; Operating Temperature: -55°C ~ 155°C; Package / Case: 0603 (1608 Metric); Packaging: TapeAndReel; PartId: 26300; Part Status: Active; Price: 0.05; Ratings: AEC-Q200; Resistance: 1 kOhms; Series: RNCF; Size / Dimension: 0.061" L x 0.031" W (1.55mm x 0.80mm); Supplier 1: DigiKey; Supplier Part Number 1: RNCF0603DTE1K00CT-ND; Supplier Device Package: 0603; Tolerance: ±0.5%

## Sheet 3V3_buck.SchDoc
size B; DocumentNumber: 2; SheetNumber: 7; SheetTotal: 7
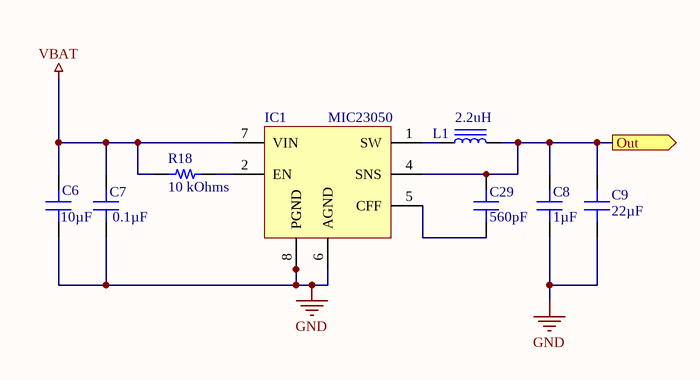
[diagram p5: 3V3_buck.SchDoc]

### Parts
C6  10µF  [CAP 0805_2012]
C7  0.1µF  [CAP 0603_1608]
C8  1µF  [CAP 0603_1608]
C9  22µF  [CAP 0805_2012]
C29  560pF  [CAP 0603_1608]
IC1  MIC23050  [MLF-8 2x2mm]
L1  2.2uH  [IND 0806_2016]
R18  10 kOhms  [RES 0603_1608]

### Ports
Out (out)

### Nets
3V3: C8.2 C9.2 C29.2 IC1.4(SNS) L1.2 ; port Out
GND: C6.1 C7.2 C8.1 C9.1 IC1.6(AGND) IC1.8(PGND) IC1.9(PGND)
VBAT: C6.2 C7.1 IC1.7(VIN) R18.2
NetC29_1: C29.1 IC1.5(CFF)
NetIC1_1: IC1.1(SW) L1.1
NetIC1_2: IC1.2(EN) R18.1

### Library data of the parts
C6 = C2012X7S1E106K125AC: CAP CER 10UF 25V X7S 0805; Manufacturer: TDK Corporation; Tolerance: ±10%; Part Number: C2012X7S1E106K125AC; Value: 10µF; Applications: General Purpose; Capacitance: 10µF; ComponentLink1Description: Datasheet; ComponentLink1URL: https://product.tdk.com/en/search/capacitor/ceramic/mlcc/info?part_no=C2012X7S1E106K125AC?ref_disty=digikey; ComponentLink2Description: DigiKey Link; ComponentLink2URL: http://digikey.com/product-detail/en/tdk-corporation/C2012X7S1E106K125AC/445-181600-1-ND/9991478; Device Package: 0805 (2012 Metric); Features: Low ESL; LastUpdated: 21-Jan-20 12:03:04 AM; Lifecycle Status: Active; Minimum Order: 1; Mounting Type: Surface Mount, MLCC; Operating Temperature: -55°C ~ 125°C; Package / Case: 0805 (2012 Metric); Packaging: TapeAndReel; PartId: 3339; Part Status: Active; Price: 0.15; Series: C; Size / Dimension: 0.079" L x 0.049" W (2.00mm x 1.25mm); Supplier 1: DigiKey; Supplier Part Number 1: 445-181600-1-ND; Temperature Coefficient: X7S; Thickness (Max): 0.057" (1.45mm); Voltage - Rated: 25V
C7 = GCG188R92A104KA03D: as C27 on sheet Top; Part Number: GCG188R92A104KA03D; Value: 0.1µF; Applications: Automotive; Capacitance: 0.1µF; ComponentLink1Description: Datasheet; ComponentLink1URL: https://search.murata.co.jp/Ceramy/image/img/A01X/G101/ENG/GCG188R92A104KA03-01.pdf; ComponentLink2Description: DigiKey Link; ComponentLink2URL: http://digikey.com/product-detail/en/murata-electronics/GCG188R92A104KA03D/490-18197-1-ND/9867926; Device Package: 0603 (1608 Metric); Features: Epoxy Mountable; LastUpdated: 21-Jan-20 12:01:59 AM; Lifecycle Status: Active; Minimum Order: 1; Mounting Type: Surface Mount, MLCC, Epoxy; Operating Temperature: -55°C ~ 150°C; Package / Case: 0603 (1608 Metric); Packaging: TapeAndReel; PartId: 9025; Part Status: Active; Price: 0.07; Ratings: AEC-Q200; Series: GCG; Size / Dimension: 0.063" L x 0.031" W (1.60mm x 0.80mm); Supplier 1: DigiKey; Supplier Part Number 1: 490-18197-1-ND; Thickness (Max): 0.035" (0.90mm); Voltage - Rated: 100V
C8 = GCJ188R71E105KA01D: as C1 on sheet Half_bridge_drivers; Part Number: GCJ188R71E105KA01D; Value: 1µF; Applications: Automotive, Boardflex Sensitive; Capacitance: 1µF; ComponentLink1Description: Datasheet; ComponentLink1URL: https://search.murata.co.jp/Ceramy/image/img/A01X/G101/ENG/GCJ188R71E105KA01-01.pdf; ComponentLink2Description: DigiKey Link; ComponentLink2URL: http://digikey.com/product-detail/en/murata-electronics/GCJ188R71E105KA01D/490-14409-1-ND/6606870; Device Package: 0603 (1608 Metric); Features: Soft Termination; LastUpdated: 21-Jan-20 12:01:58 AM; Lifecycle Status: Active; Minimum Order: 1; Mounting Type: Surface Mount, MLCC; Operating Temperature: -55°C ~ 125°C; Package / Case: 0603 (1608 Metric); Packaging: TapeAndReel; PartId: 9566; Part Status: Active; Price: 0.05; Ratings: AEC-Q200; Series: GCJ; Size / Dimension: 0.063" L x 0.031" W (1.60mm x 0.80mm); Supplier 1: DigiKey; Supplier Part Number 1: 490-14409-1-ND; Temperature Coefficient: X7R; Thickness (Max): 0.035" (0.90mm); Voltage - Rated: 25V
C9 = CL21A226MOQNNNE: CAP CER 22UF 16V X5R 0805; Manufacturer: Samsung Electro-Mechanics; Tolerance: ±20%; Part Number: CL21A226MOQNNNE; Value: 22µF; Applications: General Purpose; Capacitance: 22µF; ComponentLink1Description: Datasheet; ComponentLink1URL: http://www.samsungsem.com/kr/support/product-search/mlcc/CL21A226MOQNNNE.jsp; ComponentLink2Description: DigiKey Link; ComponentLink2URL: http://digikey.com/product-detail/en/samsung-electro-mechanics/CL21A226MOQNNNE/1276-2909-1-ND/3890995; Device Package: 0805 (2012 Metric); LastUpdated: 21-Jan-20 12:03:05 AM; Lifecycle Status: Active; Minimum Order: 1; Mounting Type: Surface Mount, MLCC; Operating Temperature: -55°C ~ 85°C; Package / Case: 0805 (2012 Metric); Packaging: TapeAndReel; PartId: 3052; Part Status: Active; Price: 0.11; Series: CL; Size / Dimension: 0.079" L x 0.049" W (2.00mm x 1.25mm); Supplier 1: DigiKey; Supplier Part Number 1: 1276-2909-1-ND; Temperature Coefficient: X5R; Thickness (Max): 0.055" (1.40mm); Voltage - Rated: 16V
C29 = GCJ188R71E105KA01D: CAP CER 1UF 25V X7R 0603; Manufacturer: Murata Electronics; Capacitance: 1µF; Tolerance: ±10%; Part Number: GCJ188R71E105KA01D; Value: 560pF; Applications: Automotive, Boardflex Sensitive; ComponentLink1Description: Datasheet; ComponentLink1URL: https://search.murata.co.jp/Ceramy/image/img/A01X/G101/ENG/GCJ188R71E105KA01-01.pdf; ComponentLink2Description: DigiKey Link; ComponentLink2URL: http://digikey.com/product-detail/en/murata-electronics/GCJ188R71E105KA01D/490-14409-1-ND/6606870; Device Package: 0603 (1608 Metric); Features: Soft Termination; LastUpdated: 21-Jan-20 12:01:58 AM; Lifecycle Status: Active; Minimum Order: 1; Mounting Type: Surface Mount, MLCC; Operating Temperature: -55°C ~ 125°C; Package / Case: 0603 (1608 Metric); Packaging: TapeAndReel; PartId: 9566; Part Status: Active; Price: 0.05; Ratings: AEC-Q200; Series: GCJ; Size / Dimension: 0.063" L x 0.031" W (1.60mm x 0.80mm); Supplier 1: DigiKey; Supplier Part Number 1: 490-14409-1-ND; Temperature Coefficient: X7R; Thickness (Max): 0.035" (0.90mm); Voltage - Rated: 25V
L1 = LQH2MPN6R8MGRL: FIXED IND 6.8UH 530MA 864 MOHM; Manufacturer: Murata Electronics; Current - Saturation: 730mA; DC Resistance (DCR): 864mOhm Max; Frequency - Self Resonant: 35MHz; Inductance: 6.8µH; Inductance Frequency - Test: 1MHz; Material - Core: Ferrite; Shielding: Shielded; Tolerance: ±20%; Type: Wirewound; Value: 6.8µH; Part Number: LQH2MPN6R8MGRL; ComponentLink1Description: Datasheet; ComponentLink1URL: https://search.murata.co.jp/Ceramy/image/img/P02/JELF243A-0142.pdf; ComponentLink2Description: DigiKey Link; ComponentLink2URL: http://digikey.com/product-detail/en/murata-electronics/LQH2MPN6R8MGRL/490-15920-1-ND/6800585; Current Rating (Amps): 530mA; Device Package: 0806 (2016 Metric); Height - Seated (Max): 0.037" (0.95mm); LastUpdated: 21-Jan-20 3:55:54 AM; Lifecycle Status: Active; Minimum Order: 1; Mounting Type: Surface Mount; Operating Temperature: -40°C ~ 105°C; Package / Case: 0806 (2016 Metric); Packaging: TapeAndReel; PartId: 3181; Part Status: Active; Price: 0.10; Series: LQH2; Size / Dimension: 0.079" L x 0.063" W (2.00mm x 1.60mm); Supplier 1: DigiKey; Supplier Part Number 1: 490-15920-1-ND; Supplier Device Package: 0806 (2016 Metric)
R18 = RNCS0603BKE10K0: as R1 on sheet Half_bridge_drivers; Part Number: RNCS0603BKE10K0; Value: 10 kOhms; ComponentLink1Description: Datasheet; ComponentLink1URL: https://www.seielect.com/catalog/sei-rncs_rnch.pdf; ComponentLink2Description: DigiKey Link; ComponentLink2URL: http://digikey.com/product-detail/en/stackpole-electronics-inc/RNCS0603BKE10K0/RNCS0603BKE10K0CT-ND/1800113; Composition: Thin Film; Device Package: 0603 (1608 Metric); Features: Anti-Corrosive, Automotive AEC-Q200, Moisture Resistant; Height - Seated (Max): 0.022" (0.55mm); LastUpdated: 21-Jan-20 12:25:01 AM; Lifecycle Status: Active; Minimum Order: 1; Number of Terminations: 2; Operating Temperature: -55°C ~ 155°C; Package / Case: 0603 (1608 Metric); Packaging: TapeAndReel; PartId: 4838; Part Status: Active; Price: 0.08; Ratings: AEC-Q200; Resistance: 10 kOhms; Series: RNCS; Size / Dimension: 0.061" L x 0.031" W (1.55mm x 0.80mm); Supplier 1: DigiKey; Supplier Part Number 1: RNCS0603BKE10K0CT-ND; Supplier Device Package: 0603; Tolerance: ±0.1%

## Sheet 1V65_LDO.SchDoc
size B; DocumentNumber: 1; SheetNumber: 6; SheetTotal: 7
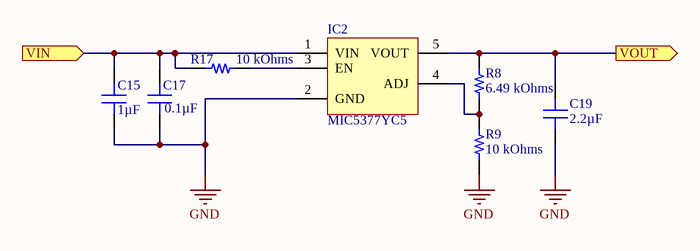
[diagram p6: 1V65_LDO.SchDoc]

### Parts
C15  1µF  [CAP 0603_1608]
C17  0.1µF  [CAP 0603_1608]
C19  2.2µF  [CAP 0603_1608]
IC2  MIC5377YC5  [TI SOT-23-5 DBV]
R8  6.49 kOhms  [RES 0603_1608]
R9  10 kOhms  [RES 0603_1608]
R17  10 kOhms  [RES 0603_1608]

### Ports
VIN (in), VOUT (out)

### Nets
1V65: C19.2 IC2.5(VOUT) R8.2 ; port VOUT
3V3: C15.2 C17.1 IC2.1(VIN) R17.2 ; port VIN
GND: C15.1 C17.2 C19.1 IC2.2(GND) R9.1
NetIC2_3: IC2.3(EN) R17.1
NetIC2_4: IC2.4(ADJ) R8.1 R9.2

### Library data of the parts
C15 = GCJ188R71E105KA01D: as C1 on sheet Half_bridge_drivers; Part Number: GCJ188R71E105KA01D; Value: 1µF; Applications: Automotive, Boardflex Sensitive; Capacitance: 1µF; ComponentLink1Description: Datasheet; ComponentLink1URL: https://search.murata.co.jp/Ceramy/image/img/A01X/G101/ENG/GCJ188R71E105KA01-01.pdf; ComponentLink2Description: DigiKey Link; ComponentLink2URL: http://digikey.com/product-detail/en/murata-electronics/GCJ188R71E105KA01D/490-14409-1-ND/6606870; Device Package: 0603 (1608 Metric); Features: Soft Termination; LastUpdated: 21-Jan-20 12:01:58 AM; Lifecycle Status: Active; Minimum Order: 1; Mounting Type: Surface Mount, MLCC; Operating Temperature: -55°C ~ 125°C; Package / Case: 0603 (1608 Metric); Packaging: TapeAndReel; PartId: 9566; Part Status: Active; Price: 0.05; Ratings: AEC-Q200; Series: GCJ; Size / Dimension: 0.063" L x 0.031" W (1.60mm x 0.80mm); Supplier 1: DigiKey; Supplier Part Number 1: 490-14409-1-ND; Temperature Coefficient: X7R; Thickness (Max): 0.035" (0.90mm); Voltage - Rated: 25V
C17 = GCG188R92A104KA03D: as C27 on sheet Top; Part Number: GCG188R92A104KA03D; Value: 0.1µF; Applications: Automotive; Capacitance: 0.1µF; ComponentLink1Description: Datasheet; ComponentLink1URL: https://search.murata.co.jp/Ceramy/image/img/A01X/G101/ENG/GCG188R92A104KA03-01.pdf; ComponentLink2Description: DigiKey Link; ComponentLink2URL: http://digikey.com/product-detail/en/murata-electronics/GCG188R92A104KA03D/490-18197-1-ND/9867926; Device Package: 0603 (1608 Metric); Features: Epoxy Mountable; LastUpdated: 21-Jan-20 12:01:59 AM; Lifecycle Status: Active; Minimum Order: 1; Mounting Type: Surface Mount, MLCC, Epoxy; Operating Temperature: -55°C ~ 150°C; Package / Case: 0603 (1608 Metric); Packaging: TapeAndReel; PartId: 9025; Part Status: Active; Price: 0.07; Ratings: AEC-Q200; Series: GCG; Size / Dimension: 0.063" L x 0.031" W (1.60mm x 0.80mm); Supplier 1: DigiKey; Supplier Part Number 1: 490-18197-1-ND; Thickness (Max): 0.035" (0.90mm); Voltage - Rated: 100V
C19 = CC0603ZRY5V5BB225: CAP CER 2.2UF 6.3V Y5V 0603; Manufacturer: Yageo; Temperature Coefficient: Y5V (F); Tolerance: -20%, +80%; Part Number: CC0603ZRY5V5BB225; Value: 2.2µF; Applications: General Purpose; Capacitance: 2.2µF; ComponentLink1Description: Datasheet; ComponentLink1URL: http://www.yageo.com/documents/recent/UPY-GPHC_Y5V_6.3V-to-50V_8.pdf; ComponentLink2Description: DigiKey Link; ComponentLink2URL: http://digikey.com/product-detail/en/yageo/CC0603ZRY5V5BB225/311-1452-1-ND/2833758; Device Package: 0603 (1608 Metric); LastUpdated: 21-Jan-20 12:02:09 AM; Lifecycle Status: Active; Minimum Order: 1; Mounting Type: Surface Mount, MLCC; Operating Temperature: -30°C ~ 85°C; Package / Case: 0603 (1608 Metric); Packaging: TapeAndReel; PartId: 2250; Part Status: Active; Price: 0.02; Series: CC; Size / Dimension: 0.063" L x 0.031" W (1.60mm x 0.80mm); Supplier 1: DigiKey; Supplier Part Number 1: 311-1452-1-ND; Thickness (Max): 0.035" (0.90mm); Voltage - Rated: 6.3V
IC2 = MIC5377YC5: IC REG LIN POS ADJ 150MA SOT23-5; Manufacturer: Texas Instruments; Control Features: Enable; Current - Quiescent (Iq): 100µA; Current - Supply (Max): 140µA; Number of Regulators: 1; Output Configuration: Positive; Output Type: Adjustable; Protection Features: Over Current, Over Temperature, Reverse Polarity; PSRR: 60dB (1kHz); Voltage - Input (Max): 10V; Voltage - Output (Max): 6.5V; Voltage - Output (Min/Fixed): 1.5V; Part Number: MIC5377YC5; ComponentLink1Description: Datasheet; ComponentLink1URL: http://www.ti.com/general/docs/suppproductinfo.tsp?distId=10&gotoUrl=http%3A%2F%2Fwww.ti.com%2Flit%2Fgpn%2Ftps763; ComponentLink2Description: DigiKey Link; ComponentLink2URL: http://digikey.com/product-detail/en/texas-instruments/TPS76301DBVR/296-11014-1-ND/477331; Current - Output: 150mA; Device Package: SC-74A, SOT-753; LastUpdated: 18-Jan-20 8:02:45 PM; Lifecycle Status: Active; Minimum Order: 1; Mounting Type: Surface Mount; Operating Temperature: -40°C ~ 125°C; Package / Case: SC-74A, SOT-753; Packaging: TapeAndReel; Part Status: Active; Price: 0.33; Series: -; Supplier 1: DigiKey; Supplier Part Number 1: 296-11014-1-ND; Supplier Device Package: SOT-23-5
R8 = RC0603FR-076K49L: RES SMD 6.49K OHM 1% 1/10W 0603; Manufacturer: Yageo; Power (Watts): 0.1W, 1/10W; Temperature Coefficient: ±100ppm/°C; Part Number: RC0603FR-076K49L; Value: 6.49 kOhms; ComponentLink1Description: Datasheet; ComponentLink1URL: https://www.yageo.com/upload/media/product/productsearch/datasheet/rchip/PYu-RC_Group_51_RoHS_L_10.pdf; ComponentLink2Description: DigiKey Link; ComponentLink2URL: http://digikey.com/product-detail/en/yageo/RC0603FR-076K49L/311-6.49KHRCT-ND/730268; Composition: Thick Film; Device Package: 0603 (1608 Metric); Features: Moisture Resistant; Height - Seated (Max): 0.022" (0.55mm); LastUpdated: 21-Jan-20 12:22:01 AM; Lifecycle Status: Active; Minimum Order: 1; Number of Terminations: 2; Operating Temperature: -55°C ~ 155°C; Package / Case: 0603 (1608 Metric); Packaging: CutTape; PartId: 12285; Part Status: Active; Price: 0.10; Resistance: 6.49 kOhms; Series: RC; Size / Dimension: 0.063" L x 0.031" W (1.60mm x 0.80mm); Supplier 1: DigiKey; Supplier Part Number 1: 311-6.49KHRCT-ND; Supplier Device Package: 0603; Tolerance: ±1%
R9 R17 = RNCS0603BKE10K0: as R1 on sheet Half_bridge_drivers; Part Number: RNCS0603BKE10K0; Value: 10 kOhms; ComponentLink1Description: Datasheet; ComponentLink1URL: https://www.seielect.com/catalog/sei-rncs_rnch.pdf; ComponentLink2Description: DigiKey Link; ComponentLink2URL: http://digikey.com/product-detail/en/stackpole-electronics-inc/RNCS0603BKE10K0/RNCS0603BKE10K0CT-ND/1800113; Composition: Thin Film; Device Package: 0603 (1608 Metric); Features: Anti-Corrosive, Automotive AEC-Q200, Moisture Resistant; Height - Seated (Max): 0.022" (0.55mm); LastUpdated: 21-Jan-20 12:25:01 AM; Lifecycle Status: Active; Minimum Order: 1; Number of Terminations: 2; Operating Temperature: -55°C ~ 155°C; Package / Case: 0603 (1608 Metric); Packaging: TapeAndReel; PartId: 4838; Part Status: Active; Price: 0.08; Ratings: AEC-Q200; Resistance: 10 kOhms; Series: RNCS; Size / Dimension: 0.061" L x 0.031" W (1.55mm x 0.80mm); Supplier 1: DigiKey; Supplier Part Number 1: RNCS0603BKE10K0CT-ND; Supplier Device Package: 0603; Tolerance: ±0.1%

## Nets that join several sheets
1V65: U_Half_bridge_drivers1 (U5_1.1), U_Half_bridge_drivers2 (U5_2.1), U_Half_bridge_drivers3 (U5_3.1), 1V65_LDO (C19.2 IC2.5 R8.2)
3V3: Top (C27.2 R15.2 U7.8), U_Half_bridge_drivers1 (C11_1.2 U5_1.3), U_Half_bridge_drivers2 (C11_2.2 U5_2.3), U_Half_bridge_drivers3 (C11_3.2 U5_3.3), Hall_sensor (9 pins), PIC32MK (15 pins), Power (R10.1), 3V3_buck (5 pins), 1V65_LDO (C15.2 C17.1 IC2.1 R17.2)
GND: Top (C27.1 C28.2 U7.4 U7.9), U_Half_bridge_drivers1 (9 pins), U_Half_bridge_drivers2 (9 pins), U_Half_bridge_drivers3 (9 pins), Hall_sensor (6 pins), PIC32MK (14 pins), Power (21 pins), 3V3_buck (7 pins), 1V65_LDO (5 pins)
VBAT: Top (C28.1 U7.1), U_Half_bridge_drivers1 (6 pins), U_Half_bridge_drivers2 (6 pins), U_Half_bridge_drivers3 (6 pins), Power (20 pins), 3V3_buck (C6.2 C7.1 IC1.7 R18.2)
Bridge_Out1: Top (P1.1), U_Half_bridge_drivers1 (R7_1.2 U5_1.4)
Bridge_Out2: Top (P2.1), U_Half_bridge_drivers2 (R7_2.2 U5_2.4)
Bridge_Out3: Top (P3.1), U_Half_bridge_drivers3 (R7_3.2 U5_3.4)
HALL_OUT1: Hall_sensor (R4.1 U2.3), PIC32MK (U6.46)
HALL_OUT2: Hall_sensor (R5.2 U3.3), PIC32MK (U6.44)
HALL_OUT3: Hall_sensor (R6.2 U4.3), PIC32MK (U6.48)
I_SENSE1: U_Half_bridge_drivers1 (U5_1.6), PIC32MK (U6.15)
I_SENSE2: U_Half_bridge_drivers2 (U5_2.6), PIC32MK (U6.14)
I_SENSE3: U_Half_bridge_drivers3 (U5_3.6), PIC32MK (U6.13)
NetU6_53: Top (U7.5), PIC32MK (U6.53)
NetU6_54: Top (U7.6), PIC32MK (U6.54)
PWMH1: U_Half_bridge_drivers1 (U1_1.8), PIC32MK (U6.60)
PWMH2: U_Half_bridge_drivers2 (U1_2.8), PIC32MK (U6.62)
PWMH3: U_Half_bridge_drivers3 (U1_3.8), PIC32MK (U6.2)
PWML1: U_Half_bridge_drivers1 (U1_1.7), PIC32MK (U6.61)
PWML2: U_Half_bridge_drivers2 (U1_2.7), PIC32MK (U6.63)
PWML3: U_Half_bridge_drivers3 (U1_3.7), PIC32MK (U6.3)

## Assembly variants
Main: not fitted P1 P2 P3 P5 R14